# EAGLE design AmigaUSBMouseV2 (EAGLE 9.1.3)
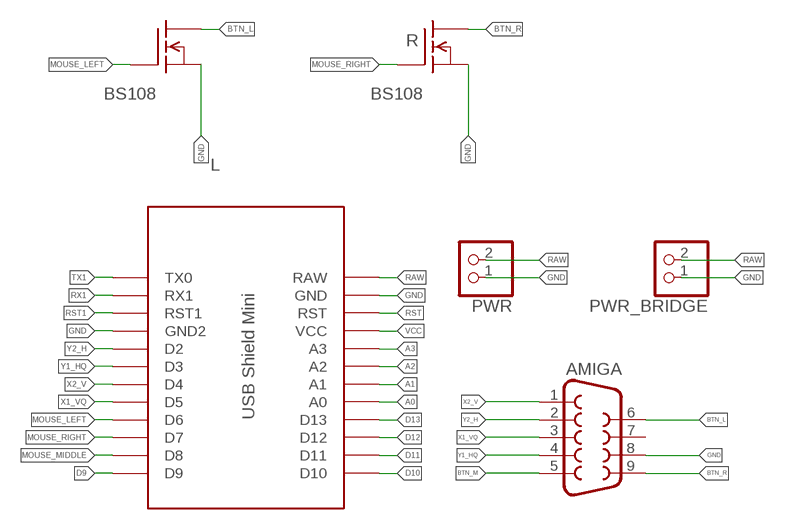
[diagram p0: schematic, sheet 1]

## Parts
AMIGA  F09D  [F09D]
L  BS108  FQN1N50CI  [TO92-INLINE]
PWR  PINHD-1X2  [1X02]
PWR_BRIDGE  PINHD-1X2  [1X02]
R  BS108  FQN1N50CI  [TO92-INLINE]
U$2  USB-SHIELD-MINI  [USB-SHIELD-MINI]

## Nets
A0: U$2.A0
A1: U$2.A1
A2: U$2.A2
A3: U$2.A3
BTN_L: AMIGA.6 L.1(D)
BTN_M [_20]: AMIGA.5
BTN_R [_20]: AMIGA.9 R.1(D)
D9: U$2.D9
D10: U$2.D10
D11: U$2.D11
D12: U$2.D12
D13: U$2.D13
GND [_20]: AMIGA.8 L.3(S) PWR.1 PWR_BRIDGE.1 R.3(S) U$2.GND U$2.GND1(GND2)
MOUSE_LEFT [_20]: L.2(G) U$2.D6
MOUSE_MIDDLE [_20]: U$2.D8
MOUSE_RIGHT [_20]: R.2(G) U$2.D7
RAW [_20]: PWR.2 PWR_BRIDGE.2 U$2.RAW
RST: U$2.RST
RST1: U$2.RST1
RX1: U$2.RX1
TX1: U$2.TX0
VCC: U$2.VCC
X1_VQ [_20]: AMIGA.3 U$2.D5
X2_V: AMIGA.1 U$2.D4
Y1_HQ [_20]: AMIGA.4 U$2.D3
Y2_H [_20]: AMIGA.2 U$2.D2
Unconnected: AMIGA.7

## Library data of the parts
AMIGA = con-subd:F09: HARTING SUB-D; OC_FARNELL: unknown
L R = adafruit:FQN1N50C: N-Channel Enhancement MOSFET 500V, 0.4A, 6.0 Ohm; OC_FARNELL: unknown
PWR PWR_BRIDGE = pinhead:PINHD-1X2: PIN HEADER; OC_FARNELL: unknown
U$2 = USBMiniHost:USB-SHIELD-MINI: USB Host Shield Mini for Pro-Mini Arduino; OC_FARNELL: unknown

## Net classes
0 default: width 0.406 mm
1 _20: width 0.508 mm

## Board
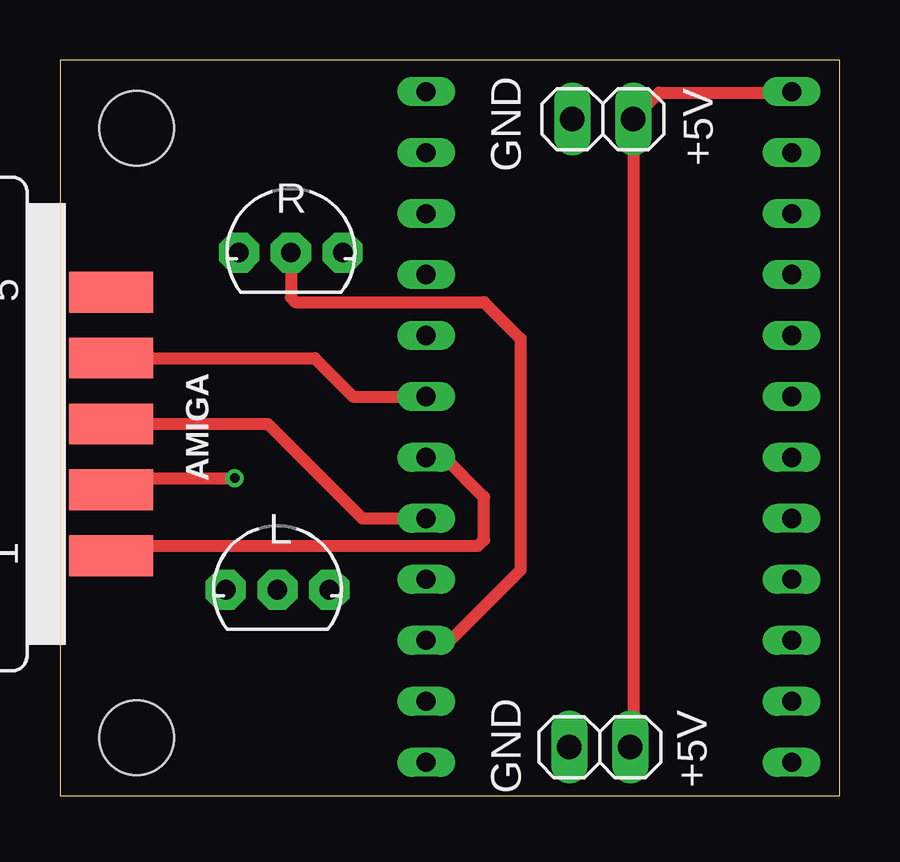
[diagram p1: board, top side]
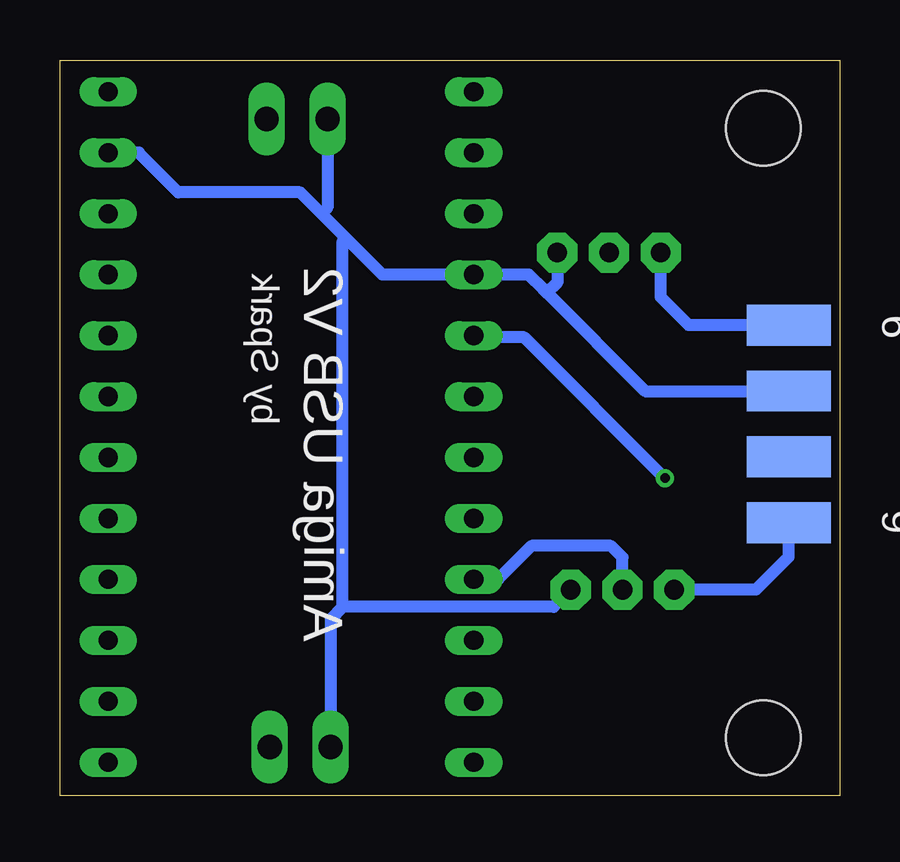
[diagram p2: board, bottom side, seen from below]

Size 32.52 x 30.66 mm. Coordinates in mm from the lower left corner, seen from the top.
Outline: 0,0 32.52,0 32.52,30.66 0,30.66 0,0
Copper layers (1*16): Top 0.035559375mm / dielectric 1.6mm / Bottom 0.035559375mm
Design rules "oshpark-2layer": minimum track width 6mil, minimum drill 10mil, track to track 6mil, track to pad 6mil, pad to pad 6mil, via to via 6mil, smd to smd 6mil, copper to edge 15mil, drill to drill 6mil, minimum pad ring 5mil, minimum via ring 5mil, stop-mask expansion 2.5mil, vias tented up to drill 0mil, thermal gap 10mil
Holes 3.1 mm at 3.2,27.81 3.2,2.41

### Footprints (pad centres in the part's own frame; a part is rotated, then mirrored left to right if it is on the bottom)
F09D = smd 1.7 x 3.5: 1 -5.486,-6.045; 2 -2.743,-6.045; 3 0,-6.045; 4 2.743,-6.045; 5 5.486,-6.045 | smd 1.7 x 3.5 bottom: 6 -4.115,-6.045; 7 -1.372,-6.045; 8 1.372,-6.045; 9 4.115,-6.045
TO92-INLINE = drill 0.813 pad 1.676 octagon: 1 -2.159,0; 2 0,0; 3 2.159,0
1X02 = drill 1.016 long: 1 -1.27,0; 2 1.27,0
USB-SHIELD-MINI = drill 0.8 long: A0 10.16,-3.81; A1 10.16,-6.35; A2 10.16,-8.89; A3 10.16,-11.43; D2 -5.08,-3.81; D3 -5.08,-6.35; D4 -5.08,-8.89; D5 -5.08,-11.43; D6 -5.08,-13.97; D7 -5.08,-16.51; D8 -5.08,-19.05; D9 -5.08,-21.59; D10 10.16,-21.59; D11 10.16,-19.05; D12 10.16,-16.51; D13 10.16,-13.97; GND 10.16,3.81; GND1 -5.08,-1.27; RAW 10.16,6.35; RST 10.16,1.27; RST1 -5.08,1.27; RX1 -5.08,3.81; TX0 -5.08,6.35; VCC 10.16,-1.27

### Placement (x,y rotation side)
AMIGA  -3.91,15.49 90 top
L  9.07,8.59 0 top
PWR  22.63,28.19 0 top
PWR_BRIDGE  22.5,2.03 0 top
R  9.63,22.63 0 top
U$2  20.35,22.99 0 top

### Tracks (layer width: path | path; a pad name or v marks a point on that pad's centre or on a via)
BTN_L
  Bottom 0.508: L.1 3.51,8.59 2.13,9.96 AMIGA.6
BTN_R
  Bottom 0.508: AMIGA.9 6.3,19.61 7.47,20.78 R.1
GND
  Bottom 0.508: 12.22,20.95 8.13,16.87 AMIGA.8 | 12.22,20.95 12.34,21.08 12.98,21.72 U$2.GND1 19.08,21.72 20.6,23.24 | PWR.1 21.36,24.51 21.62,24.26 | U$2.GND 29.24,26.8 27.58,25.15 22.5,25.15 21.62,24.26 | L.3 11.94,7.87 20.73,7.87 | 20.73,7.87 20.73,23.11 20.6,23.24 | R.3 11.79,21.39 12.22,20.95 | 20.73,7.87 21.23,7.37 PWR_BRIDGE.1 | 20.6,23.24 21.62,24.26
MOUSE_LEFT
  Bottom 0.508: L.2 9.07,9.93 9.55,10.41 12.85,10.41 14.25,9.02 U$2.D6
MOUSE_RIGHT
  Top 0.508: U$2.D7 16.03,6.48 16.15,6.35 19.2,9.4 19.2,19.05 17.68,20.57 9.8,20.57 9.63,20.75 R.2
RAW
  Top 0.508: U$2.RAW 30.43,29.3 24.98,29.3 24,28.32 PWR.2 23.9,2.16 PWR_BRIDGE.2
X1_VQ
  Top 0.508: AMIGA.3 8.66,15.49 12.6,11.56 U$2.D5
X2_V
  Top 0.508: AMIGA.1 2.54,10.41 17.42,10.41 17.68,10.67 17.68,12.45 16.03,14.1 U$2.D4
Y1_HQ
  Top 0.508: AMIGA.4 10.62,18.24 12.22,16.64 U$2.D3
Y2_H  (via drill 0.4 pad 0.75)
  Top 0.508: v7.29,13.23 2.63,13.23 2.21,12.81 AMIGA.2
  Bottom 0.508: v7.29,13.23 13.16,19.1 15.2,19.1 U$2.D2

### Text on the board
tNames: GND | +5V | GND | +5V
bNames: by Spark | Amiga USB V2